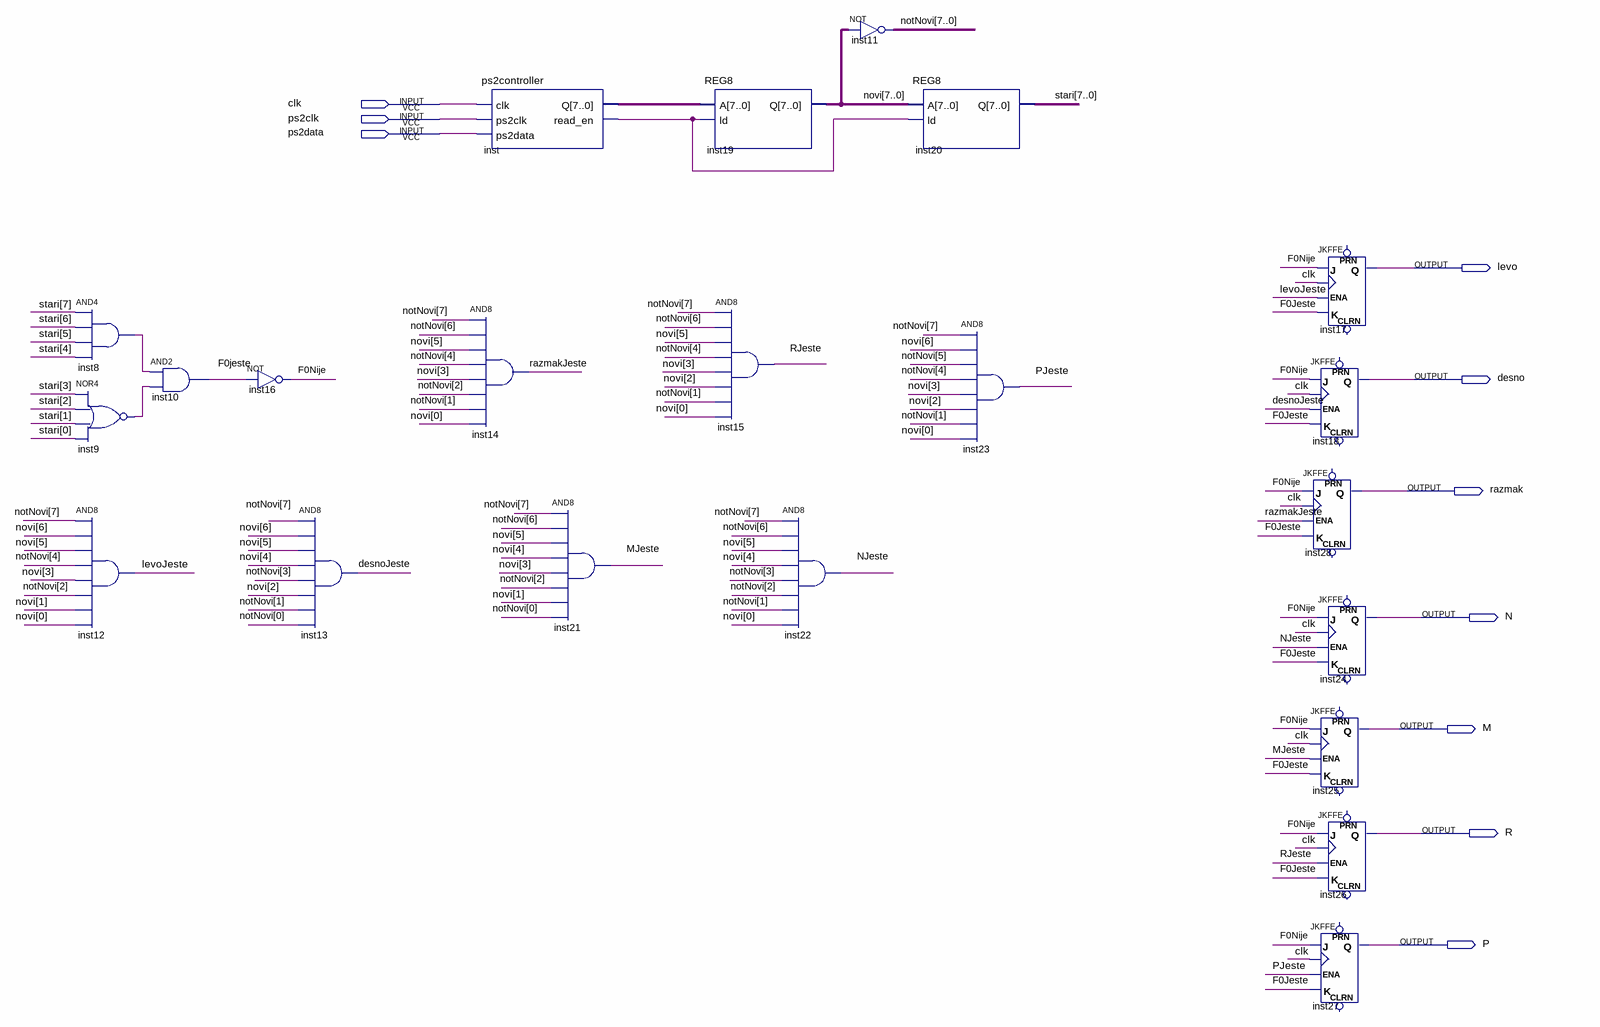
[diagram p0: schematic sheet]
// Quartus schematic keyboard.bdf as structural Verilog: 22 symbols, 10 pins
module keyboard (
  input  clk,
  input  ps2clk,
  input  ps2data,
  output levo,
  output desno,
  output razmak,
  output N,
  output M,
  output R,
  output P
);

  wire desnoJeste, F0jeste, F0Nije, inst8_out, inst9_out, inst_read_en, levoJeste, MJeste, NJeste, PJeste,
       razmakJeste, RJeste;
  wire [7:0] inst_q, notNovi, novi, stari;

  and inst8 (inst8_out, stari[7], stari[6], stari[5], stari[4]);
  nor inst9 (inst9_out, stari[3], stari[2], stari[1], stari[0]);
  and inst12 (levoJeste, notNovi[7], novi[6], novi[5], notNovi[4], novi[3], notNovi[2], novi[1], novi[0]);
  and inst10 (F0jeste, inst8_out, inst9_out);
  not inst16 (F0Nije, F0jeste);
  and inst13 (desnoJeste, notNovi[7], novi[6], novi[5], novi[4], notNovi[3], novi[2], notNovi[1], notNovi[0]);
  ps2controller inst (.clk(clk), .ps2clk(ps2clk), .ps2data(ps2data), .Q(inst_q), .read_en(inst_read_en));
  and inst14 (razmakJeste, notNovi[7], notNovi[6], novi[5], notNovi[4], novi[3], notNovi[2], notNovi[1], novi[0]);
  and inst21 (MJeste, notNovi[7], notNovi[6], novi[5], novi[4], novi[3], notNovi[2], novi[1], notNovi[0]);
  REG8 inst19 (.A(inst_q), .ld(inst_read_en), .Q(novi));
  and inst15 (RJeste, notNovi[7], notNovi[6], novi[5], notNovi[4], novi[3], novi[2], notNovi[1], novi[0]);
  and inst22 (NJeste, notNovi[7], notNovi[6], novi[5], novi[4], notNovi[3], notNovi[2], notNovi[1], novi[0]);
  assign notNovi = ~novi;  // NOT inst11, 8 bits wide
  REG8 inst20 (.A(novi), .ld(inst_read_en), .Q(stari));
  and inst23 (PJeste, notNovi[7], novi[6], notNovi[5], notNovi[4], novi[3], novi[2], notNovi[1], novi[0]);
  JKFFE inst17 (.J(F0Nije), .CLK(clk), .K(F0jeste), .ENA(levoJeste), .Q(levo));  // open: PRN, CLRN
  JKFFE inst18 (.J(F0Nije), .CLK(clk), .K(F0jeste), .ENA(desnoJeste), .Q(desno));  // open: PRN, CLRN
  JKFFE inst28 (.J(F0Nije), .CLK(clk), .K(F0jeste), .ENA(razmakJeste), .Q(razmak));  // open: PRN, CLRN
  JKFFE inst24 (.J(F0Nije), .CLK(clk), .K(F0jeste), .ENA(NJeste), .Q(N));  // open: PRN, CLRN
  JKFFE inst25 (.J(F0Nije), .CLK(clk), .K(F0jeste), .ENA(MJeste), .Q(M));  // open: PRN, CLRN
  JKFFE inst26 (.J(F0Nije), .CLK(clk), .K(F0jeste), .ENA(RJeste), .Q(R));  // open: PRN, CLRN
  JKFFE inst27 (.J(F0Nije), .CLK(clk), .K(F0jeste), .ENA(PJeste), .Q(P));  // open: PRN, CLRN
endmodule
